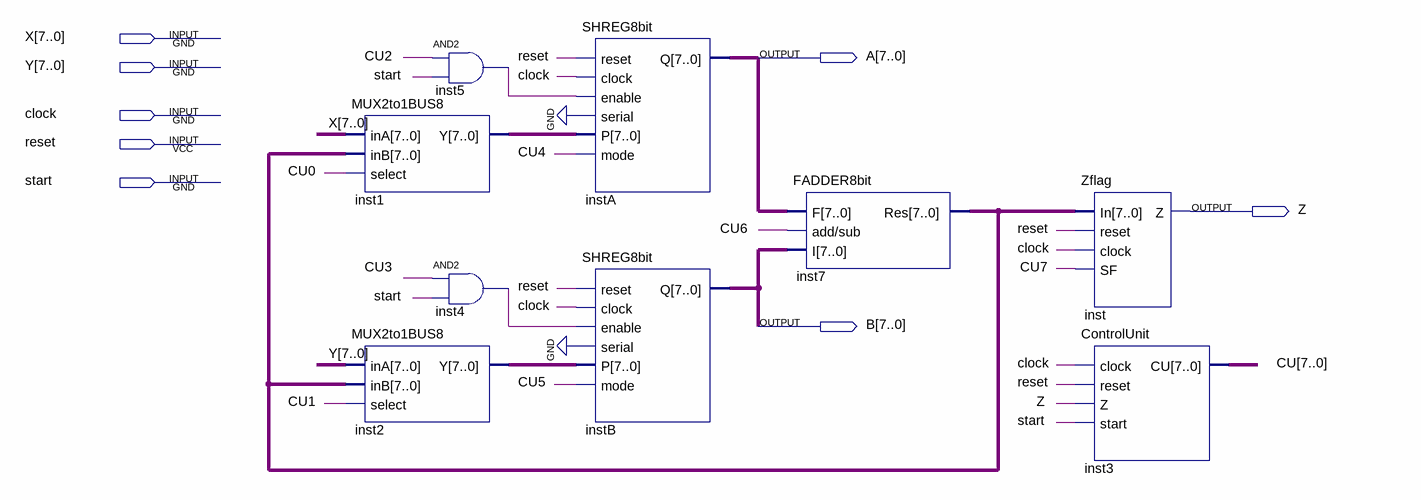
[diagram p0: schematic sheet]
// Quartus schematic Lab4.bdf as structural Verilog: 9 symbols, 8 pins
module Lab4 (
  input  [7:0] X,
  input  [7:0] Y,
  input  clock,
  input  reset,
  input  start,
  output [7:0] A,
  output Z,
  output [7:0] B
);

  wire inst4_out, inst5_out;
  wire [7:0] CU, inst1_y, inst2_y, inst7_res;

  MUX2to1BUS8 inst1 (.inA(X), .inB(inst7_res), .select(CU[0]), .Y(inst1_y));
  MUX2to1BUS8 inst2 (.inA(Y), .inB(inst7_res), .select(CU[1]), .Y(inst2_y));
  and inst5 (inst5_out, CU[2], start);
  and inst4 (inst4_out, CU[3], start);
  SHREG8bit instA (.reset(reset), .clock(clock), .enable(inst5_out), .serial(1'b0), .P(inst1_y), .mode(CU[4]), .Q(A));
  SHREG8bit instB (.reset(reset), .clock(clock), .enable(inst4_out), .serial(1'b0), .P(inst2_y), .mode(CU[5]), .Q(B));
  FADDER8bit inst7 (.F(A), .\add/sub (CU[6]), .I(B), .Res(inst7_res));
  Zflag inst (.In(inst7_res), .reset(reset), .clock(clock), .SF(CU[7]), .Z(Z));
  ControlUnit inst3 (.clock(clock), .reset(reset), .Z(Z), .start(start), .CU(CU));
endmodule
